# EAGLE design firefly-ice-blue-fixture (EAGLE 6.4)
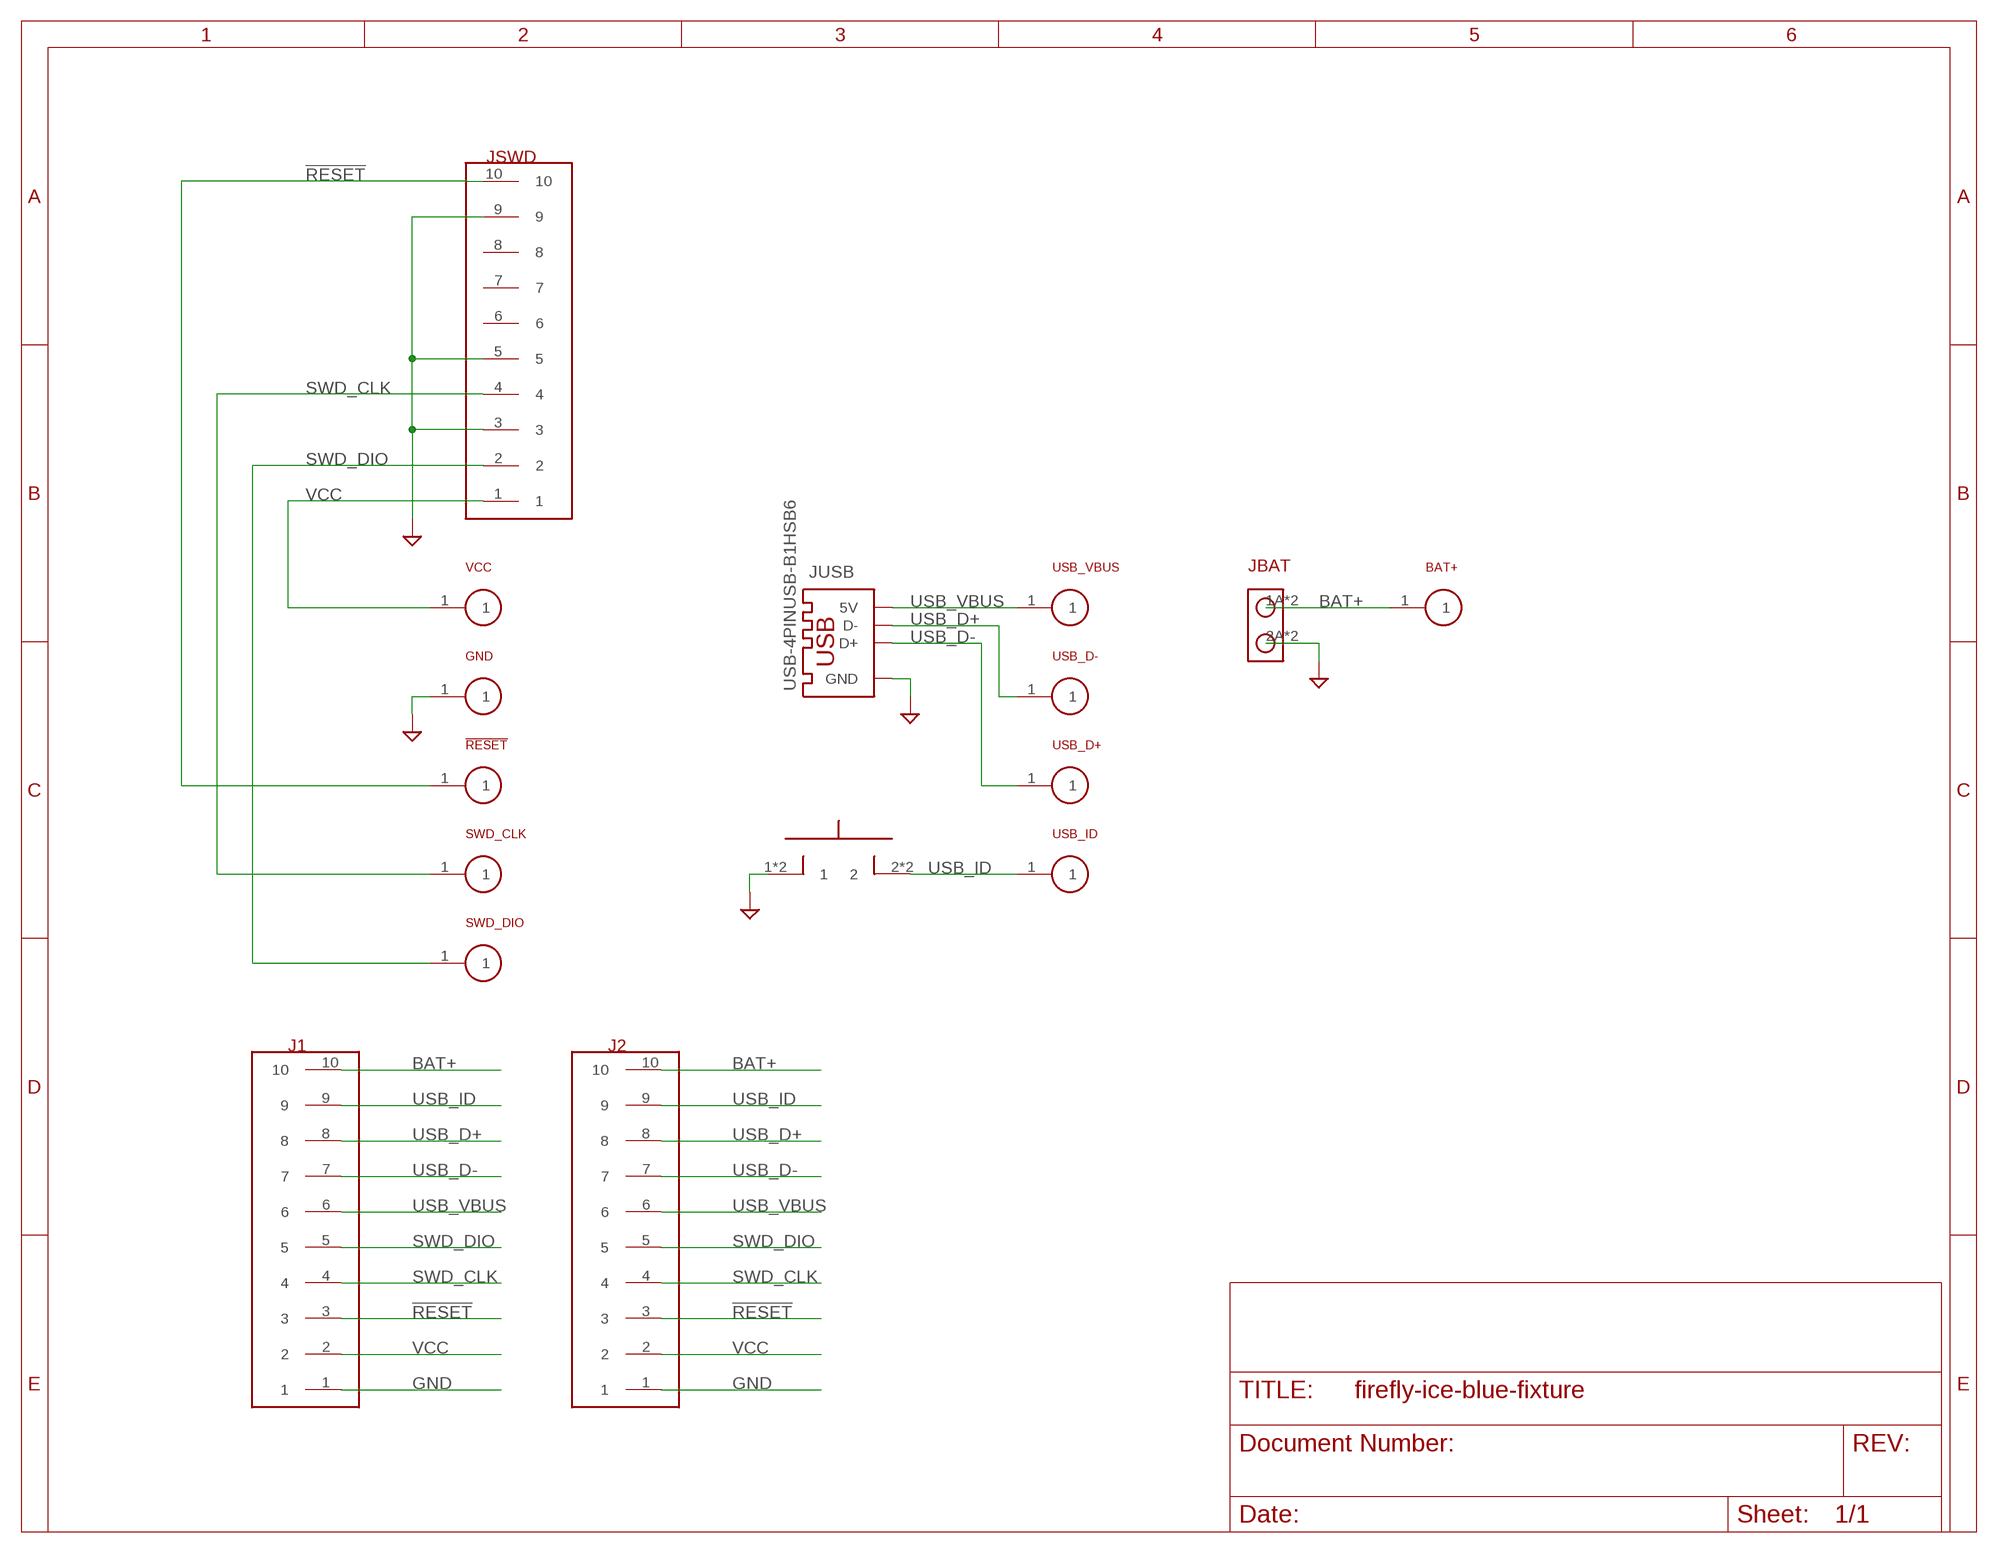
[diagram p0: schematic, sheet 1]

## Parts
!RESET  TARGET-PINPROBE-0985  [PROBE-0985]
BAT+  TARGET-PINPROBE-0985  [PROBE-0985]
GND  TARGET-PINPROBE-0985  [PROBE-0985]
J1  CON-10  [CON-HEADER-10]
J2  CON-10  [CON-HEADER-10]
JBAT  CON-220020303-D021B01LF  [20020303-D021B01LF]
JSWD  CON-10SWD  [SWD-10]
JUSB  USB-4PINUSB-B1HSB6  [USB-B1HSB6]
SRES  SPST-NOKS-01Q-01  [KS-01Q-01]
SWD_CLK  TARGET-PINPROBE-0985  [PROBE-0985]
SWD_DIO  TARGET-PINPROBE-0985  [PROBE-0985]
USB_D+  TARGET-PINPROBE-0985  [PROBE-0985]
USB_D-  TARGET-PINPROBE-0985  [PROBE-0985]
USB_ID  TARGET-PINPROBE-0985  [PROBE-0985]
USB_VBUS  TARGET-PINPROBE-0985  [PROBE-0985]
VCC  TARGET-PINPROBE-0985  [PROBE-0985]

## Nets
!RESET: !RESET.1 J1.3 J2.3 JSWD.10
BAT+: BAT+.1 J1.10 J2.10 JBAT.1A JBAT.1B
GND: GND.1 J1.1 J2.1 JBAT.2A JBAT.2B JSWD.3 JSWD.5 JSWD.9 JUSB.4(GND) SRES.1 SRES.3
SWD_CLK: J1.4 J2.4 JSWD.4 SWD_CLK.1
SWD_DIO: J1.5 J2.5 JSWD.2 SWD_DIO.1
USB_D+: J1.8 J2.8 JUSB.2(D-) USB_D-.1
USB_D-: J1.7 J2.7 JUSB.3(D+) USB_D+.1
USB_ID: J1.9 J2.9 SRES.2 SRES.4 USB_ID.1
USB_VBUS: J1.6 J2.6 JUSB.1(5V) USB_VBUS.1
VCC: J1.2 J2.2 JSWD.1 VCC.1
Unconnected: JSWD.6 JSWD.7 JSWD.8

## Library data of the parts
!RESET BAT+ GND SWD_CLK SWD_DIO USB_D+ USB_D- USB_ID USB_VBUS VCC = firefly:TARGET-PIN
J1 J2 = firefly:CON-10
JBAT = firefly:CON-2; MANUFACTURER: FCI; ORDERING-CODE: 20020303-D021B01LF
JSWD = firefly:CON-10; MANUFACTURE: Harwin Inc; ORDERING-CODE: M50-3500542
JUSB = firefly:USB-4PIN; MANUFACTURER: On Shore Technology Inc; ORDERING-CODE: USB-B1HSB6
SRES = firefly:SPST-NO; MANUFACTURER: E-Switch; ORDERING-CODE: KS-01Q-01

## Board
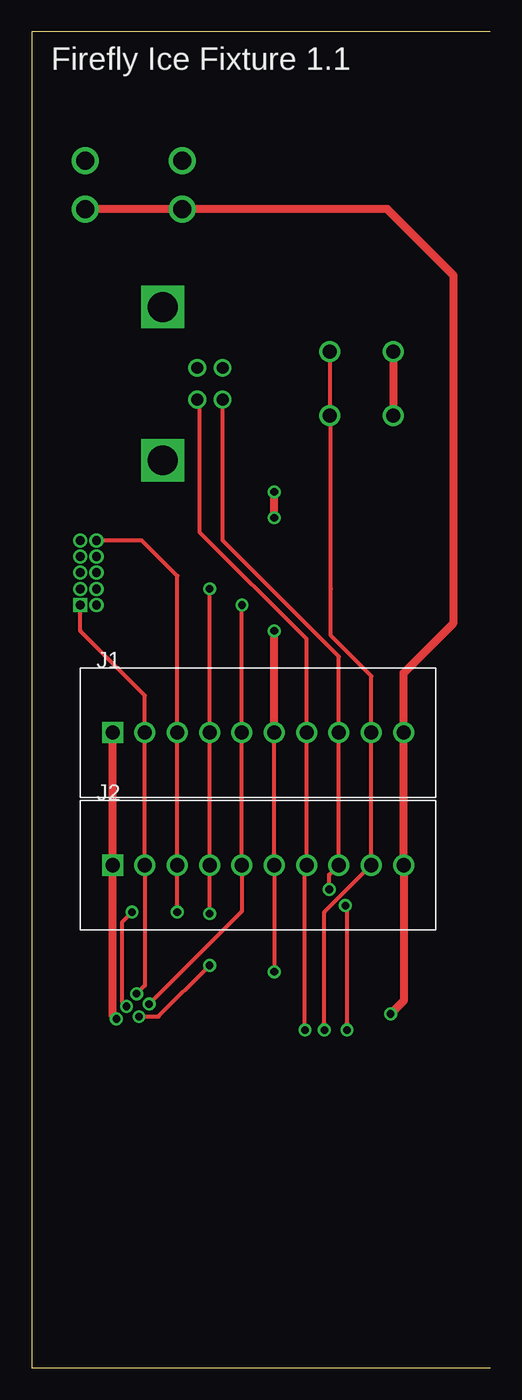
[diagram p1: board, top side]
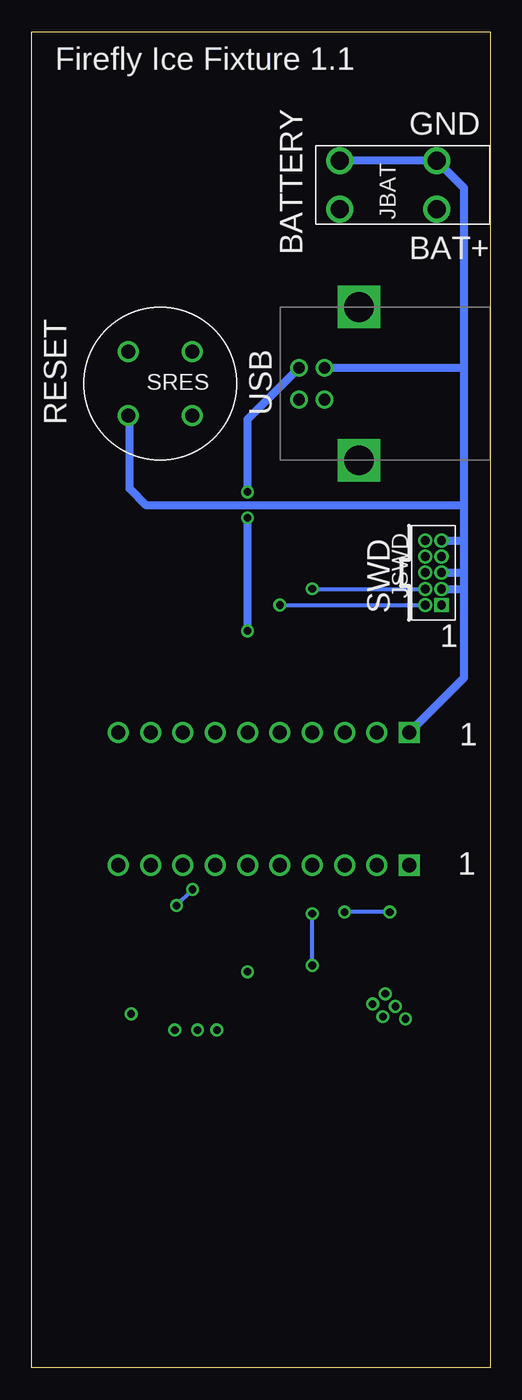
[diagram p2: board, bottom side, seen from below]

Size 36 x 105 mm. Coordinates in mm from the lower left corner, seen from the top.
Outline: 36,0 0,0 0,105 36,105
Copper layers (1*16): Top 0.035mm / dielectric 1.5mm / Bottom 0.035mm
Design rules "default *": minimum track width 6mil, minimum drill 13mil, track to track 6mil, track to pad 6mil, pad to pad 6mil, via to via 6mil, smd to smd 6mil, copper to edge 40mil, drill to drill 8mil, minimum pad ring 8mil, minimum via ring 8mil, stop-mask expansion 4mil, vias tented up to drill 0mil, thermal gap 10mil

### Footprints (pad centres in the part's own frame; a part is rotated, then mirrored left to right if it is on the bottom)
PROBE-0985 = drill 0.6: 1 0,0
CON-HEADER-10 = drill 1.102 square: 1 -11.43,0 | drill 1.102: 2 -8.89,0; 3 -6.35,0; 4 -3.81,0; 5 -1.27,0; 6 1.27,0; 7 3.81,0; 8 6.35,0; 9 8.89,0; 10 11.43,0
20020303-D021B01LF = drill 1.4: 1A -1.905,3.81; 1B -1.905,-3.81; 2A 1.905,3.81; 2B 1.905,-3.81
SWD-10 = drill 0.7 pad 1 square: 1 -2.54,-0.635 | drill 0.7 pad 1: 2 -2.54,0.635; 3 -1.27,-0.635; 4 -1.27,0.635; 5 0,-0.635; 6 0,0.635; 7 1.27,-0.635; 8 1.27,0.635; 9 2.54,-0.635; 10 2.54,0.635
USB-B1HSB6 = drill 0.92: 1 1.25,4.71; 2 -1.25,4.71; 3 -1.25,2.71; 4 1.25,2.71 | drill 2.33 square: MA -6.02,0; MB 6.02,0
KS-01Q-01 = drill 1.1: 1 -2.5,2.5; 2 2.5,2.5; 3 -2.5,-2.5; 4 2.5,-2.5

### Placement (x,y rotation side)
!RESET  7.44,28.4 0 top
BAT+  28.19,27.81 0 top
GND  6.64,27.41 0 top
J1  17.78,49.91 0 top
J2  17.78,39.5 0 top
JBAT  8,92.96 90 bottom
JSWD  4.45,62.48 90 bottom
JUSB  10.29,77.34 90 bottom
SRES  25.91,77.34 0 bottom
SWD_CLK  8.42,27.6 0 top
SWD_DIO  9.22,28.59 0 top
USB_D+  21.46,26.54 0 top
USB_D-  24.77,26.54 0 top
USB_ID  22.99,26.54 0 top
USB_VBUS  19.05,31.11 0 top
VCC  8.23,29.39 0 top

### Tracks (layer width: path | path; a pad name or v marks a point on that pad's centre or on a via)
!RESET  (via drill 0.6)
  Top 0.305: !RESET.1 7.11,28.73 7.11,35.05 v7.87,35.81 | v11.43,35.81 J2.3 J1.3 11.43,62.23 8.64,65.02 JSWD.10
  Bottom 0.305: v7.87,35.81 v11.43,35.81
BAT+
  Top 0.61: BAT+.1 29.21,28.83 J2.10 J1.10 29.21,54.61 33.15,58.55 33.15,85.85 27.94,91.06 JBAT.1A JBAT.1B
GND
  Top 0.61: GND.1 6.35,27.71 J2.1 J1.1 | SRES.1 SRES.3
  Bottom 0.61: J1.1 2.03,54.23 2.03,61.21 | 2.03,61.21 2.03,62.48 | 2.03,62.48 2.03,65.02 | 2.03,65.02 2.03,67.82 | 2.03,67.82 2.03,78.61 | 2.03,78.61 2.03,92.71 JBAT.2B JBAT.2A | JUSB.4 2.05,78.59 2.03,78.61 | 2.03,67.82 27.05,67.82 28.32,69.09 28.32,74.8 SRES.3 | JSWD.9 2.03,65.02 | JSWD.5 2.03,62.48 | JSWD.3 2.03,61.21
SWD_CLK  (via drill 0.6)
  Top 0.305: SWD_CLK.1 9.94,27.6 v13.97,31.62 | v13.97,35.69 J2.4 J1.4 v13.97,61.21
  Bottom 0.305: v13.97,31.62 v13.97,35.69 | v13.97,61.21 JSWD.4
SWD_DIO  (via drill 0.6)
  Top 0.305: SWD_DIO.1 16.51,35.88 J2.5 J1.5 v16.51,59.94
  Bottom 0.305: v16.51,59.94 JSWD.2
USB_D+  (via drill 0.6)
  Top 0.305: USB_D-.1 24.77,36.2 v24.64,36.32 | v23.37,37.59 23.37,38.73 J2.8 J1.8 24.13,55.88 14.99,65.02 14.99,76.08 JUSB.2
  Bottom 0.305: v24.64,36.32 v23.37,37.59
USB_D-
  Top 0.305: USB_D+.1 21.46,39.37 J2.7 J1.7 21.59,57.28 13.21,65.66 13.21,75.88 JUSB.3
USB_ID
  Top 0.305: USB_ID.1 22.99,35.81 J2.9 J1.9 26.67,54.36 23.5,57.53 23.5,61.21 23.5,74.8 23.45,74.84 SRES.4 SRES.2
USB_VBUS  (via drill 0.6)
  Top 0.305: USB_VBUS.1 J2.6 J1.6
  Top 0.61: J1.6 v19.05,57.91 | v19.05,66.8 v19.05,68.83
  Bottom 0.61: v19.05,57.91 v19.05,66.8 | v19.05,68.83 19.05,74.54 JUSB.1
VCC
  Top 0.305: VCC.1 8.89,30.04 J2.2 J1.2 8.89,52.83 3.81,57.91 JSWD.1

### Text on the board
tSilk: Firefly Ice Fixture 1.1
bSilk: Firefly Ice Fixture 1.1 | BATTERY | GND | BAT+ | RESET | USB | SWD | 1 | 1 | 1